# Altium schematic sheet MCU_main-Sheet_1.SchDoc
size A3
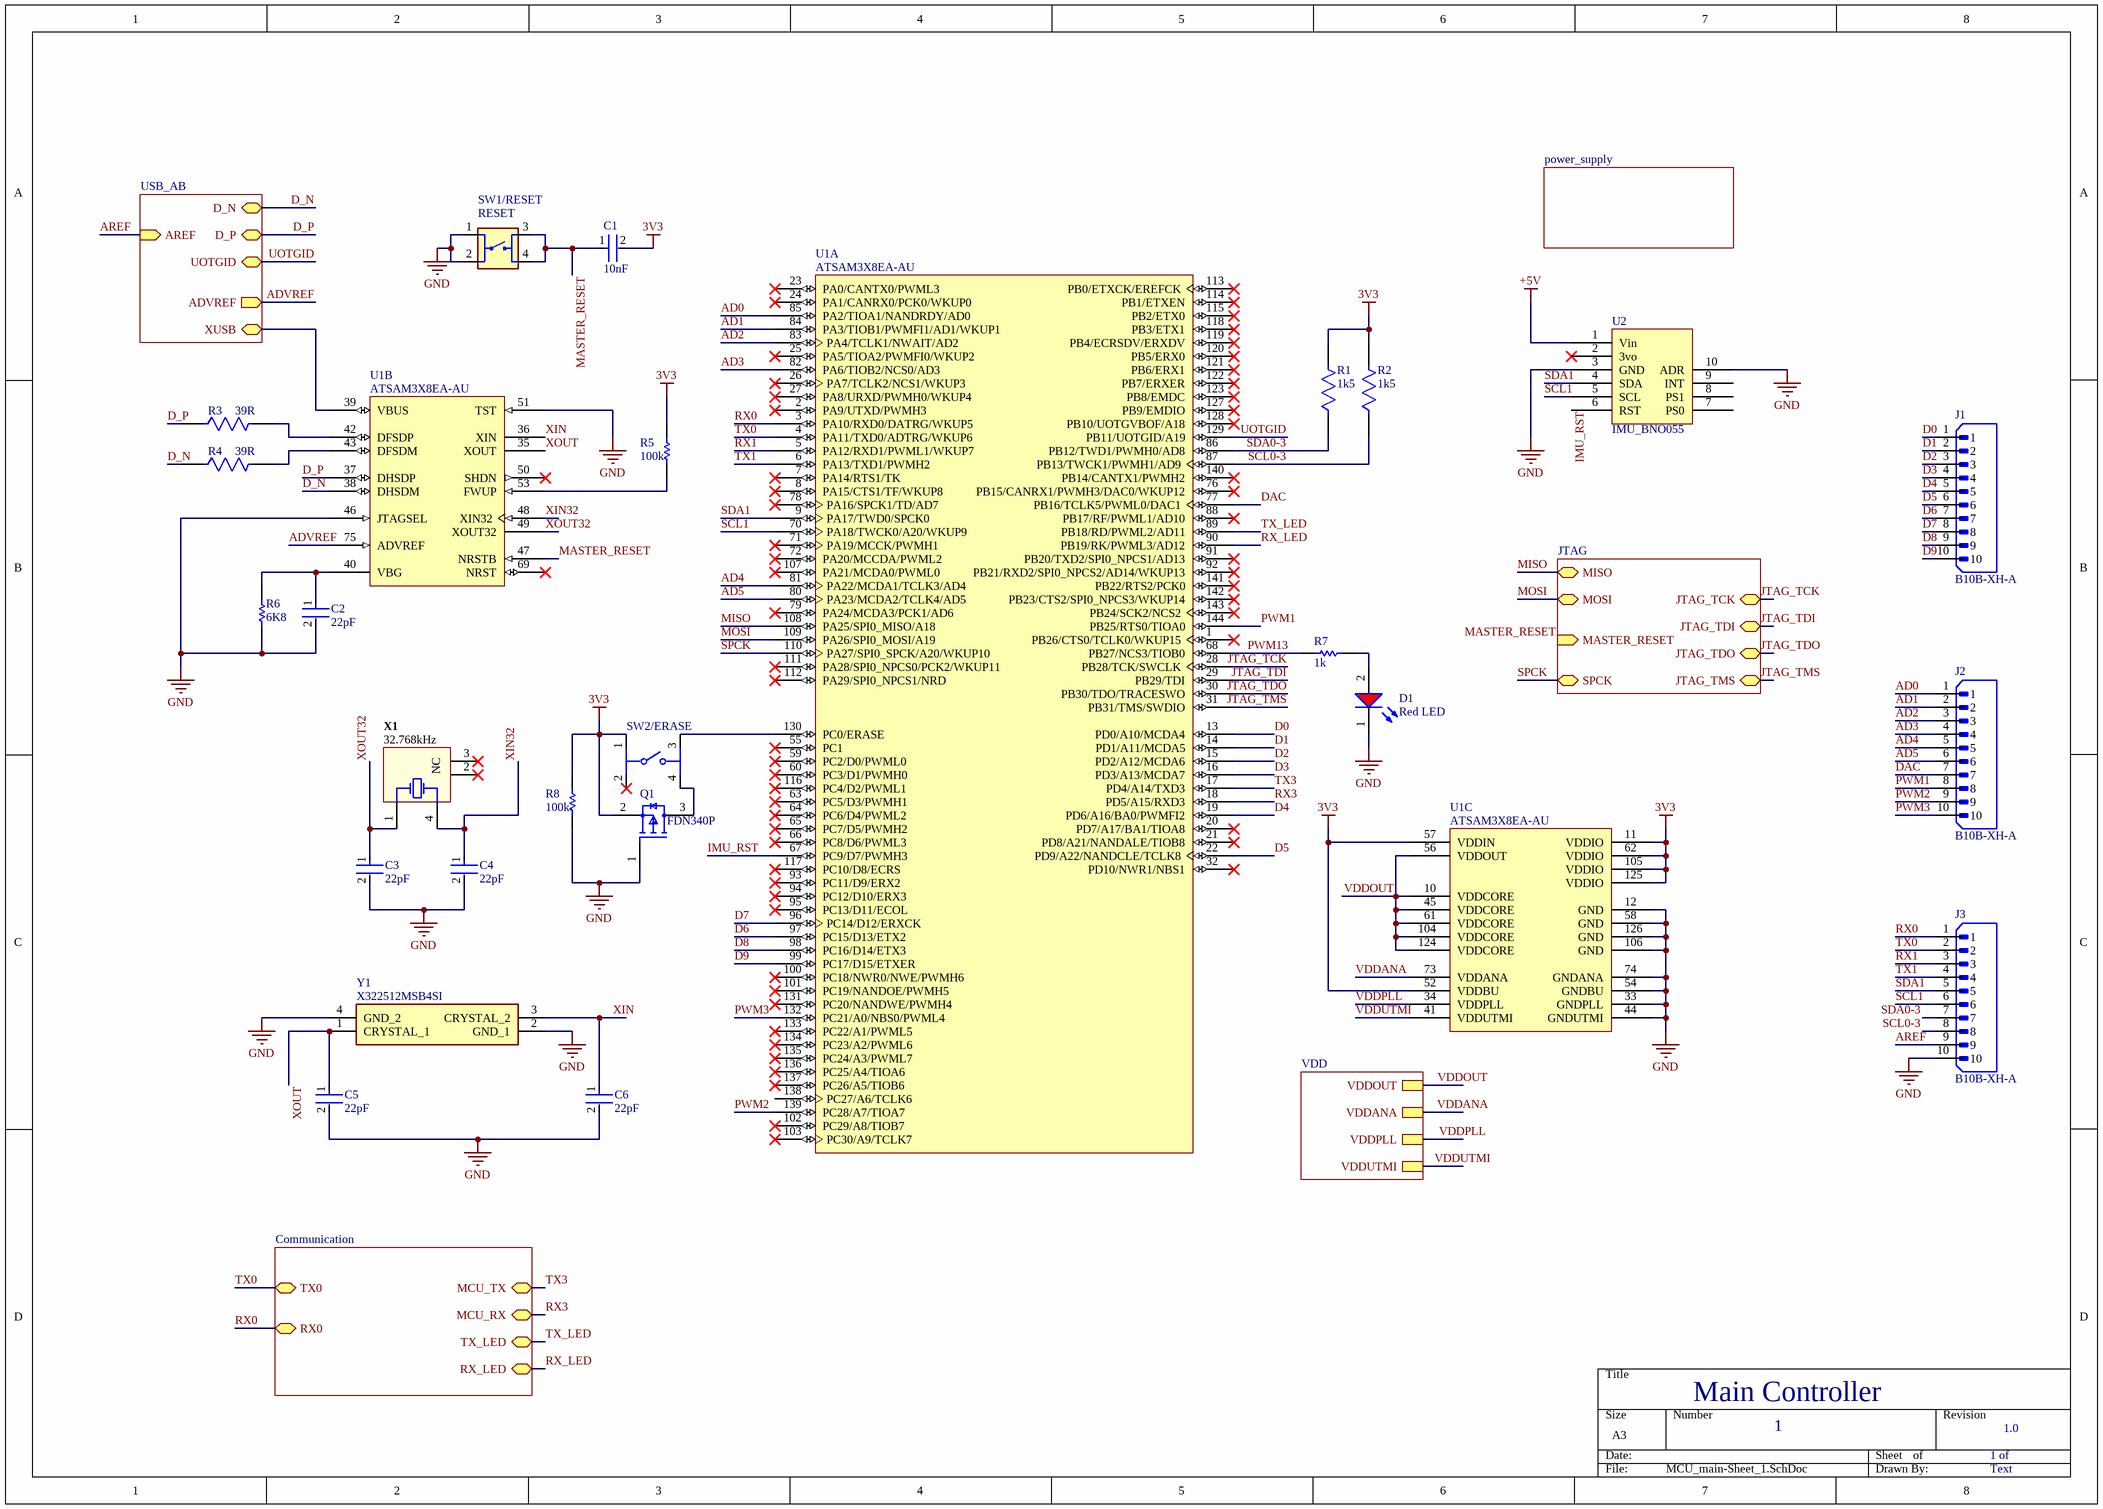
[diagram p0: MCU_main-Sheet_1.SchDoc]

## Parts
C1  10nF  [FP-C0805C-DN-MFG]
C2  22pF  [FP-C0805C-DN-MFG]
C3  22pF  [FP-C0805C-DN-MFG]
C4  22pF  [FP-C0805C-DN-MFG]
C5  22pF  [FP-C0805C-DN-MFG]
C6  22pF  [FP-C0805C-DN-MFG]
D1  Red LED  [WL-SMCW_0603_150060xx75000]
J1  B10B-XH-A  [JST_B10B-XH-A]
J2  B10B-XH-A  [JST_B10B-XH-A]
J3  B10B-XH-A  [JST_B10B-XH-A]
Q1  FDN340P  [FP-527AG-MFG]
R1  1k5  [FP-RT0805-MFG]
R2  1k5  [FP-RT0805-MFG]
R3  39R  [FP-RK73H2A-MFG]
R4  39R  [FP-RK73H2A-MFG]
R5  100k  [RESC2013X50X30ML20T20]
R6  6K8  [RESC2013X50X30LL20T20]
R7  1k  [RESC2013X60X35ML10T20]
R8  100k  [RESC2013X50X30ML20T20]
SW1/RESET  RESET  [TE_4-1437565-9]
SW2/ERASE  3-1825910-1  [FP-3-1825910-1-MFG]  (value not drawn)
U1  ATSAM3X8EA-AU  [LQFP144_M]  (parts A,B,C of 3)
U2  IMU_BNO055  [IMU_BNO055-Footprint-1]
X1  32.768kHz  [ABRA-ABS25-4_V]
Y1  X322512MSB4SI  [X322512MSB4SI]

## Sub-sheets
Communication = Communication: MCU_TX (bidir), MCU_RX (bidir), TX_LED (bidir), RX_LED (bidir), RX0 (bidir), TX0 (bidir)
JTAG = JTAG: JTAG_TDI (bidir), JTAG_TCK (bidir), JTAG_TDO (bidir), JTAG_TMS (bidir), MASTER_RESET (in), MOSI (bidir), MISO (bidir), SPCK (bidir)
power_supply = power_supply: no entries
USB_AB = USB_AB: D_N (bidir), D_P (bidir), UOTGID (bidir), XUSB (bidir), ADVREF (out), AREF (in)
VDD = VDD: VDDOUT, VDDANA, VDDPLL, VDDUTMI

## Nets
3V3: C1.2 Q1.2(S) R1.2 R2.2 R5.2 R8.2 SW2/ERASE.1 U1.11(VDDIO) U1.52(VDDBU) U1.57(VDDIN) U1.62(VDDIO) U1.105(VDDIO) U1.125(VDDIO)
+5V: U2.1(Vin)
GND: C2.2 C3.2 C4.2 C5.2 C6.2 D1.1(K) J3.10 Q1.1(G) R6.1 R8.1 SW1/RESET.1 SW1/RESET.2 U1.12(GND) U1.33(GNDPLL) U1.44(GNDUTMI) U1.46(JTAGSEL) U1.51(TST) U1.54(GNDBU) U1.58(GND) U1.74(GNDANA) U1.106(GND) U1.126(GND) U2.3(GND) U2.10(ADR) Y1.2(GND_1) Y1.4(GND_2)
AD0: J2.1 U1.85(PA2/TIOA1/NANDRDY/AD0)
AD1: J2.2 U1.84(PA3/TIOB1/PWMFI1/AD1/WKUP1)
AD2: J2.3 U1.83(PA4/TCLK1/NWAIT/AD2)
AD3: J2.4 U1.82(PA6/TIOB2/NCS0/AD3)
AD4: J2.5 U1.81(PA22/MCDA1/TCLK3/AD4)
AD5: J2.6 U1.80(PA23/MCDA2/TCLK4/AD5)
ADVREF: U1.75(ADVREF) ; sheet USB_AB/ADVREF
AREF: J3.9 ; sheet USB_AB/AREF
D0: J1.1 U1.13(PD0/A10/MCDA4)
D1: J1.2 U1.14(PD1/A11/MCDA5)
D2: J1.3 U1.15(PD2/A12/MCDA6)
D3: J1.4 U1.16(PD3/A13/MCDA7)
D4: J1.5 U1.19(PD6/A16/BA0/PWMFI2)
D5: J1.6 U1.22(PD9/A22/NANDCLE/TCLK8)
D6: J1.7 U1.97(PC15/D13/ETX2)
D7: J1.8 U1.96(PC14/D12/ERXCK)
D8: J1.9 U1.98(PC16/D14/ETX3)
D9: J1.10 U1.99(PC17/D15/ETXER)
D_N: R4.1 U1.38(DHSDM) ; sheet USB_AB/D_N
D_P: R3.1 U1.37(DHSDP) ; sheet USB_AB/D_P
DAC: J2.7 U1.77(PB16/TCLK5/PWML0/DAC1)
IMU_RST: U1.67(PC9/D7/PWMH3) U2.6(RST)
JTAG_TCK: U1.28(PB28/TCK/SWCLK) ; sheet JTAG/JTAG_TCK
JTAG_TDI: U1.29(PB29/TDI) ; sheet JTAG/JTAG_TDI
JTAG_TDO: U1.30(PB30/TDO/TRACESWO) ; sheet JTAG/JTAG_TDO
JTAG_TMS: U1.31(PB31/TMS/SWDIO) ; sheet JTAG/JTAG_TMS
MASTER_RESET: C1.1 SW1/RESET.3 SW1/RESET.4 U1.47(NRSTB) ; sheet JTAG/MASTER_RESET
MISO: U1.108(PA25/SPI0_MISO/A18) ; sheet JTAG/MISO
MOSI: U1.109(PA26/SPI0_MOSI/A19) ; sheet JTAG/MOSI
PWM1: J2.8 U1.144(PB25/RTS0/TIOA0)
PWM2: J2.9 U1.139(PC28/A7/TIOA7)
PWM3: J2.10 U1.132(PC21/A0/NBS0/PWML4)
PWM13: R7.2 U1.68(PB27/NCS3/TIOB0)
RX0: J3.1 U1.3(PA10/RXD0/DATRG/WKUP5) ; sheet Communication/RX0
RX1: J3.3 U1.5(PA12/RXD1/PWML1/WKUP7)
RX3: U1.18(PD5/A15/RXD3) ; sheet Communication/MCU_RX
RX_LED: U1.90(PB19/RK/PWML3/AD12) ; sheet Communication/RX_LED
SCL0-3: J3.8 R2.1 U1.87(PB13/TWCK1/PWMH1/AD9)
SCL1: J3.6 U1.70(PA18/TWCK0/A20/WKUP9) U2.5(SCL)
SDA0-3: J3.7 R1.1 U1.86(PB12/TWD1/PWMH0/AD8)
SDA1: J3.5 U1.9(PA17/TWD0/SPCK0) U2.4(SDA)
SPCK: U1.110(PA27/SPI0_SPCK/A20/WKUP10) ; sheet JTAG/SPCK
TX0: J3.2 U1.4(PA11/TXD0/ADTRG/WKUP6) ; sheet Communication/TX0
TX1: J3.4 U1.6(PA13/TXD1/PWMH2)
TX3: U1.17(PD4/A14/TXD3) ; sheet Communication/MCU_TX
TX_LED: U1.89(PB18/RD/PWML2/AD11) ; sheet Communication/TX_LED
UOTGID: U1.129(PB11/UOTGID/A19) ; sheet USB_AB/UOTGID
VDDANA: U1.73(VDDANA) ; sheet VDD/VDDANA
VDDOUT: U1.10(VDDCORE) U1.45(VDDCORE) U1.56(VDDOUT) U1.61(VDDCORE) U1.104(VDDCORE) U1.124(VDDCORE) ; sheet VDD/VDDOUT
VDDPLL: U1.34(VDDPLL) ; sheet VDD/VDDPLL
VDDUTMI: U1.41(VDDUTMI) ; sheet VDD/VDDUTMI
XIN: C6.1 U1.36(XIN) Y1.3(CRYSTAL_2)
XIN32: C4.1 U1.48(XIN32) X1.4(X2)
XOUT: C5.1 U1.35(XOUT) Y1.1(CRYSTAL_1)
XOUT32: C3.1 U1.49(XOUT32) X1.1(X1)
NetC2_1: C2.1 R6.2 U1.40(VBG)
NetD1_2: D1.2(A) R7.1
NetQ1_3: Q1.3(D) SW2/ERASE.4
NetR3_2: R3.2 U1.42(DFSDP)
NetR4_2: R4.2 U1.43(DFSDM)
NetR5_1: R5.1 U1.53(FWUP)
NetSW2/ERASE_3: SW2/ERASE.3 U1.130(PC0/ERASE)
NetU1_39: U1.39(VBUS) ; sheet USB_AB/XUSB

Not connected (* = marked no-connect by the designer): SW2/ERASE 2*; U1 1(PB26/CTS0/TCLK0/WKUP15)* 2(PA9/UTXD/PWMH3)* 7(PA14/RTS1/TK)* 8(PA15/CTS1/TF/WKUP8)* 20(PD7/A17/BA1/TIOA8)* 21(PD8/A21/NANDALE/TIOB8)* 23(PA0/CANTX0/PWML3)* 24(PA1/CANRX0/PCK0/WKUP0)* 25(PA5/TIOA2/PWMFI0/WKUP2)* 26(PA7/TCLK2/NCS1/WKUP3)* 27(PA8/URXD/PWMH0/WKUP4)* 32(PD10/NWR1/NBS1)* 50(SHDN)* 55(PC1)* 59(PC2/D0/PWML0)* 60(PC3/D1/PWMH0)* 63(PC5/D3/PWMH1)* 64(PC6/D4/PWML2)* 65(PC7/D5/PWMH2)* 66(PC8/D6/PWML3)* 69(NRST)* 71(PA19/MCCK/PWMH1)* 72(PA20/MCCDA/PWML2)* 76(PB15/CANRX1/PWMH3/DAC0/WKUP12)* 78(PA16/SPCK1/TD/AD7)* 79(PA24/MCDA3/PCK1/AD6)* 88(PB17/RF/PWML1/AD10)* 91(PB20/TXD2/SPI0_NPCS1/AD13)* 92(PB21/RXD2/SPI0_NPCS2/AD14/WKUP13)* 93(PC11/D9/ERX2)* 94(PC12/D10/ERX3)* 95(PC13/D11/ECOL)* 100(PC18/NWR0/NWE/PWMH6)* 101(PC19/NANDOE/PWMH5)* 102(PC29/A8/TIOB7)* 103(PC30/A9/TCLK7)* 107(PA21/MCDA0/PWML0)* 111(PA28/SPI0_NPCS0/PCK2/WKUP11)* 112(PA29/SPI0_NPCS1/NRD)* 113(PB0/ETXCK/EREFCK)* 114(PB1/ETXEN)* 115(PB2/ETX0)* 116(PC4/D2/PWML1)* 117(PC10/D8/ECRS)* 118(PB3/ETX1)* 119(PB4/ECRSDV/ERXDV)* 120(PB5/ERX0)* 121(PB6/ERX1)* 122(PB7/ERXER)* 123(PB8/EMDC)* 127(PB9/EMDIO)* 128(PB10/UOTGVBOF/A18)* 131(PC20/NANDWE/PWMH4)* 133(PC22/A1/PWML5)* 134(PC23/A2/PWML6)* 135(PC24/A3/PWML7)* 136(PC25/A4/TIOA6)* 137(PC26/A5/TIOB6)* 138(PC27/A6/TCLK6) 140(PB14/CANTX1/PWMH2)* 141(PB22/RTS2/PCK0)* 142(PB23/CTS2/SPI0_NPCS3/WKUP14)* 143(PB24/SCK2/NCS2)*; U2 2(3vo)* 7(PS0) 8(PS1) 9(INT); X1 2(NC)* 3(NC)*

## Notes on the sheet
- Main Controller
- 1
- 1 of
- 1.0
- Text

## Library data of the parts
C1 = CMP-2007-00259-2: CAP CER 10000PF 200V X7R 0805; Manufacturer Part Number: C0805C103K2RACTU; Manufacturer: KEMET; Material: Ceramic; Temperature Coefficient: 30ppm/°C; Capacitance: 10,000 pF; Tolerance: 0.1; Value: 10,000 pF; Device Class L2: Capacitors; Voltage Rating: 200 V; Temperature Range High: +125°C; ComponentLink2Description: Datasheet; Height: 0.88mm; Octopart: https://octopart.com/c0805c103k2ractu-kemet-9138347; ComponentLink2URL: https://content.kemet.com/datasheets/KEM_C1003_C0G_SMD.pdf; Category: Cap; Temperature: -55°C to +125°C; Temperature Range Low: -55°C; Digikey Description: CAP CER 10000PF 200V X7R 0805; Temperature Characteristic: X7R; Automotive: No; Device Class L3: Ceramic Capacitors; Mouser Description: KEMET - C0805C103K2RACTU - CAP, MLCC, X7R, 10NF, 200V, 0805; RoHS: TRUE; Device Class L1: Passive Components; Lead Free: Yes; Package: C0805C-DN; Ipc Land Pattern Name: CAPC200125X78
C2-C6 = CMP-2007-00048-2: Capacitor; Ceramic; Cap; 22.0pF; Tol 5%; SMT; Vol-Rtg 50V; C0G; Tape and Reel; Manufacturer: KEMET; Manufacturer Part Number: C0805C220J5GACTU; Temperature Coefficient: 30ppm/°C; Tolerance: 0.05; Device Class L1: Passive Components; Mouser Description: Multilayer Ceramic Capacitors MLCC - SMD/SMT 50volts 22pF C0G 5%; Temperature Range Low: -55°C; Automotive: No; Voltage Rating: 50 V; Material: Ceramic; Category: Cap; Height: 0.88mm; Temperature Range High: +125°C; Capacitance: 22 pF; Digikey Description: Capacitor; Ceramic; Cap; 22.0pF; Tol 5%; SMT; Vol-Rtg 50V; C0G; Tape and Reel; Octopart: https://octopart.com/c0805c220j5gactu-kemet-145470; ComponentLink2Description: Datasheet; Device Class L2: Capacitors; Ipc Land Pattern Name: CAPC200125X78; Value: 22 pF; RoHS: TRUE; ComponentLink2URL: https://content.kemet.com/datasheets/KEM_C1003_C0G_SMD.pdf; Temperature: -55°C to +125°C; Device Class L3: Ceramic Capacitors; Lead Free: Yes; Temperature Characteristic: C0G; Package: C0805C-DN
D1 = CMP-1426-00001-4: LED Low-Power Uni-Color Red 630nm 2V 2-Pin Chip 0603(1608Metric) T/R; Max Junction Temperature (Tj): 95°C; Dominant Wavelength: 625nm; Lens Style: Clear, Rectangular; Viewing Angle: 140°; Forward Current: 100mA; Max Reverse Voltage (DC): 5V; Luminous Intensity: 250mcd; Test Current: 20mA; Power Dissipation: 72mW; Max Operating Temperature: 85°C; Mount: Surface Mount; Height: 700µm; Packaging: Tape and Reel; REACH SVHC: Unknown; Case Code (Metric): 1608; Peak Wavelength: 630nm; Forward Voltage: 2V; Case/Package: 0603; Color: Red; RoHS: Compliant; Width: 800µm; Reverse Voltage: 5V; Min Operating Temperature: -40°C; Wavelength: 625nm; Case Code (Imperial): 0603; Length: 1.6mm
J1-J3 = B10B-XH-A: MF: {'manufacturer': u'JST Sales America Inc.'}; Package: None; Price: None; Value: *; MP: B10B-XH-A; Availability: Unavailable
Q1 = CMP-2100-03638-2: MOSFET P-CH 20V 2A SSOT3; Fall Time: 11ns; Rise Time: 9ns; Voltage Rating (DC): -20V; Power Dissipation: 500mW; Nominal Vgs: -800mV; Current Rating: -2A; Gate to Source Voltage (Vgs): 8V; Rds On Max: 70mR; Turn-Off Delay Time: 27ns; Element Configuration: Single; Number of Elements: 1; Input Capacitance: 779pF; Drain to Source Resistance: 60mR; Turn-On Delay Time: 10ns; Package Quantity: 1; Mount: Surface Mount; Case/Package: SOT-23; Min Operating Temperature: -55°C; REACH SVHC: No SVHC; Weight: 0.03g; Packaging: Tape and Reel; Threshold Voltage: -800mV; Max Operating Temperature: 150°C; Dual Supply Voltage: -20V; Termination: SMD/SMT; Drain to Source Voltage (Vdss): 20V; Height: 0.94mm; Length: 2.92mm; Contact Plating: Tin; Width: 3.05mm; Drain to Source Breakdown Voltage: -20V; Max Power Dissipation: 500mW; Continuous Drain Current (ID): 2A; Number of Pins: 3; Lead Free: Lead Free; Radiation Hardening: No; On-State Resistance: 70MR
R1 R2 = CMP-03412-013884-1: RES SMD 1.5K OHM 0.25% 1/8W 0805; Manufacturer Part Number: RT0805CRE071K5L; Manufacturer: Yageo; Resistance: 1.5KΩ; Power Rating: 0.125W; Temperature Coefficient: 50 ppm/°C; Tolerance: 0.005; Voltage Rating: 150V; Value: 1.5KΩ; Temperature Range Low: -55°C; Height: 0.6mm; Octopart: https://octopart.com/rt0805cre071k5l-yageo-1182744; Lead Free: Yes; Device Class L2: Resistors; Package: RT0805; Device Class L1: Passive Components; Composition: Thin Film; Automotive: No; Temperature Range High: +155°C; Category: Res; Temperature: -55°C to +155°C; Device Class L3: Chip SMD Resistors; RoHS: TRUE; Digikey Description: RES SMD 1.5K OHM 0.25% 1/8W 0805; Footprint Url: http://www.yageo.com/exep/pages/download/literatures/PYu-R_Mount_10.pdf; ComponentLink2Description: Datasheet; ComponentLink2URL: http://www.yageo.com/documents/recent/PYu-RT_1-to-0.01_RoHS_L_9.pdf; Ipc Land Pattern Name: RESC200125X50; Series: RT
R3 R4 = CMP-04015-075652-1: 39Ω ±1% 0.25W Chip Resistor 0805 Flat Chip (Anti-Sulfuration) AEC-Q200 Qualified; Power Rating: 125mW; Temperature Coefficient: 100ppm/°C; Voltage Rating: 150V; Case Code (Imperial): 0805; Case/Package: 0805; Weight: 0.000194oz; Package Quantity: 5000; Resistance: 39R; Height: 0.5mm; Max Operating Temperature: 155°C; RoHS Compliant: Yes; Termination: SMD/SMT; Min Operating Temperature: -55°C; Tolerance: 1%; Packaging: Tape and Reel; Length: 2mm; Case Code (Metric): 2012; Width: 1.2mm
R5 R8 = CMP-2001-04900-1: Fixed Resistor, Metal Glaze/thick Film, 0.125W, 100000ohm, 150V, 5% +/-Tol, 200ppm/Cel, Surface Mount, 0805; Manufacturer: Vishay Dale; Part Number: CRCW0805100KJNEA
R6 = CMP-2001-04089-1: Manufacturer: Vishay Dale; Part Number: CRCW08056K80JNEA
R7 = CMP-2100-03671-1: Chip Resistor, 1 KOhm, +/- 1%, 125 mW, -55 to 155 degC, 0805 (2012 Metric), RoHS, Tape and Reel; Manufacturer: Yageo; Temperature Coefficient: 100ppm/degreesC; Voltage Rating (DC): 150V; Max Power Dissipation: 125mW; Resistance: 1KOhm; Number of Pins: 2; Number of Terminations: 2; Datasheet URL: http://www.yageo.com/NewPortal/yageodocoutput?fileName=/pdf/R-Chip/PYu-RC_Group_51_RoHS_L_5.pdf; Length: 0.079inch; Package Description: 2-Pin Surface Mounted Device, Body 2 x 1.25 mm; Depth: 1.25mm; Height: 0.024inch; Military Standard: Not; Case/Package: 0805; Package Reference: 0805; RoHSCompliant: true; Lead Free: LeadFree; Packaging: TapeandReel; Package Quantity: 1; Datasheet Version: Rev. 5, 10/2016; Tolerance: 1%; Min Operating Temperature: -55degC; Voltage Rating: 150V; Composition: ThickFilm; Case Code (Imperial): 0805; Power Rating: 125mW; Width: 0.049inch; Case Code (Metric): 2012; Manufacturer URL: http://www.yageo.com/; Max Operating Temperature: 155degC; REACH SVHC: Unknown; Termination: SMD/SMT
SW1/RESET = 4-1437565-9: Alcoswitch, Switch, Tactile, 50 mA, SPST, Pushbutton, Off[On], FSM6JSMA | TE Connectivity FSM6JSMA; Contact_Current_Rating: 50 mA; Configuration_Pole-Throw: Single Pole - Single Throw; SnapEDA_Link: https://www.snapeda.com/parts/FSM6JSMA/TE+Connectivity+ALCOSWITCH+Switches/view-part/?ref=snap; Package: None; Value: *; MF: TE Connectivity; MP: FSM6JSMA; EU_RoHS_Compliance: Compliant; Check_prices: https://www.snapeda.com/parts/FSM6JSMA/TE+Connectivity+ALCOSWITCH+Switches/view-part/?ref=eda
SW2/ERASE = CMP-03407-000001-1: SWITCH TACTILE SPST-NO 0.05A 24V; Manufacturer: TE Connectivity; Operating Force: 160gf; Contact Current Rating: 50mA; Contact Resistance: 100mΩ; Electromechanical Life: 100000Cycles; Device Class L1: Electromechanical; ComponentLink2URL: https://www.te.com/commerce/DocumentDelivery/DDEController?Action=srchrtrv&DocNm=1825910&DocType=Customer+Drawing&DocLang=English; Category: Switch; Device Class L2: Switches; Temperature: -35°C to +85°C; RoHS: TRUE; Mount: Through Hole; Manufacturer Part Number: 3-1825910-1; Automotive: No; Lead Free: Yes; Device Class L3: Tactile Switches; ComponentLink2Description: Datasheet; Temperature Range High: +85°C; Height: 17.3mm; Package: 0; Temperature Range Low: -35°C; Throw Configuration: SPST-NO; Digikey Description: SWITCH TACTILE SPST-NO 0.05A 24V; Octopart: https://octopart.com/3-1825910-1-te+connectivity-46506874
U1 = CMP-0076-00188-1: SAM3X ARM Cortex-M3 Flash-based Microcontroller, 512 KB Flash, 96 KB SRAM, 103 User I/Os, 1.62 to 3.6 V, -40 to 85 degC, 144-Pin LQFP, RoHS; Manufacturer: Atmel; UART: 5; Max. Operating Freq.: 84 MHz; ADC Resolution: 12 bits; Flash: 512 Kbytes; ADC Channels: 16; SRAM: 96 Kbytes; Max I/O Pins: 103; DAC Channels: 2; SPI: 4; # of Touch Channels: 32; Mounting Technology: Surface Mount; Operating Voltage: 1.62 to 3.6 V; ComponentLink2URL: http://www.atmel.com/Images/doc11057.pdf; CAN: 2; ComponentLink1Description: Manufacturer URL; RoHS: TRUE; PartNumber: ATSAM3X8EA-AU; Temp. Range: -40 to 85 degC; PackageVersion: 11057B; PackageDescription: 100-Pin Quad Flat Package, Body 20 x 20 mm, Pitch 0.5 mm; ComponentLink2Description: Datasheet; DatasheetVersion: 11057B; ComponentLink1URL: http://www.atmel.com/; ComponentLink3Description: Package Specification; ComponentLink3URL: http://www.atmel.com/Images/doc11057.pdf; PackageReference: LQFP-144
U2 = CMP-010-00026-2: IMU Sensor; Min Supply Voltage: 3.3V; Max Supply Voltage: 5V; ComponentLink1Description: Datasheet; Sensor Type: IMU; Mounting Technology: Through Hole; Case/Package: Module; Pins: 10; ComponentLink1URL: https://cdn-learn.adafruit.com/downloads/pdf/adafruit-bno055-absolute-orientation-sensor.pdf
X1 = CMP-2000-05036-1: Low Frequency Crystal, 32.768 KHz, 6 pF, +/- 20 ppm, -40 to 85 degC, 4-Pin SMD, RoHS, Tape and Reel; Manufacturer: Abracon; Tolerance: 20PPM; ESR: 50kOhms; Case Width: 3.8mm; Case Height: 2.5mm; Case Length: 8mm; Load Capacitance: 6pF; Operating Temperature Range: -40Cto+85C; Package Reference: ABS25; Factory Pack Quantity: 3000; Package Description: 4-Pin Surface Mount Device, Body 8 x 3.8 mm, Pitch 5.5 mm; Frequency: 32.768kHz; Termination Style: SMD/SMT; Manufacturer URL: http://www.abracon.com/; Type: LowFrequencyCrystal; Dimensions: 3.8mmWx8mmLx2.5mmH; Product Category: Crystals; Series: ABS25; RoHS: Details; Package / Case: 8mmx3.8mm; Datasheet Version: Jun-17; Brand: ABRACON; Datasheet URL: https://datasheet.ciiva.com/854/abs25-854528.pdf; Packaging: Reel; Mounting Style: SMD/SMT
Y1 = X322512MSB4SI: Crystal or Oscillator; Manufacturer_Name: Yangxing Tech; Datasheet Link: https://datasheet.lcsc.com/szlcsc/Yangxing-Tech-X322512MSB4SI_C9002.pdf; Height: 0.8mm; Manufacturer_Part_Number: X322512MSB4SI